# Altium schematic sheet 3Wheel_MotorDrivers_Encoders.SchDoc: Motor Controller
size A4; Organization: University of Guelph; Address1: 50 Stone Rd. E.; Address2: Guelph, Ontario; Address3: N1G 2M7; DocumentNumber: 1; Revision: 0.2; SheetNumber: 1; SheetTotal: 1
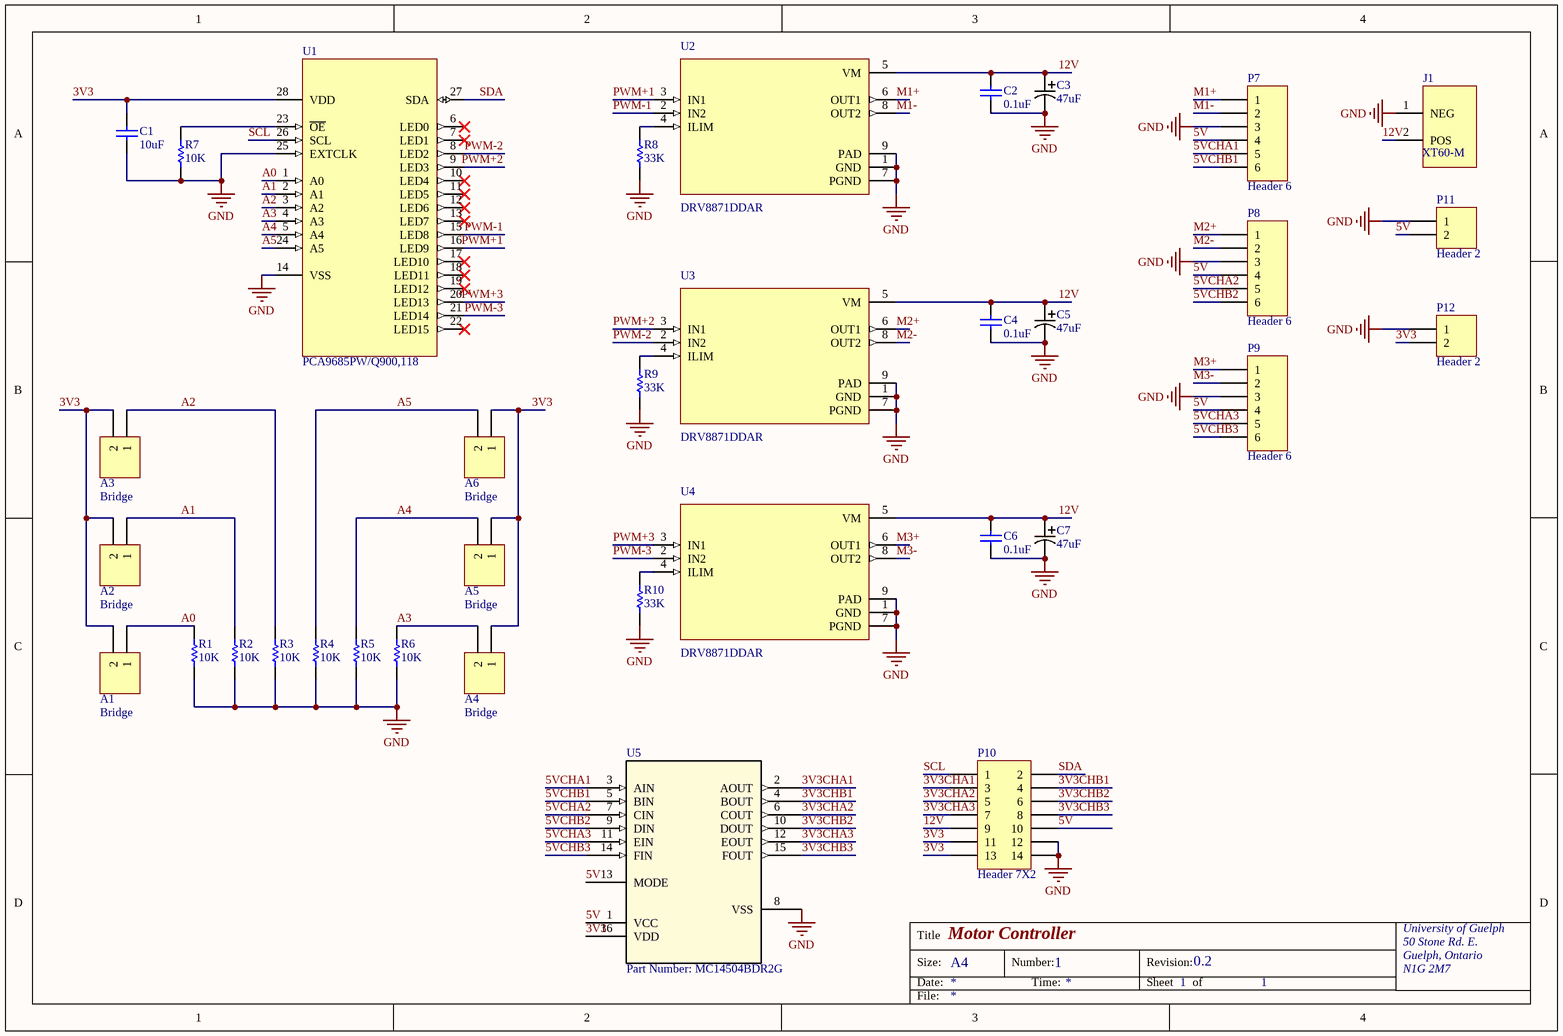
[diagram p0: 3Wheel_MotorDrivers_Encoders.SchDoc]

## Parts
A1  Bridge  [0603]
A2  Bridge  [0603]
A3  Bridge  [0603]
A4  Bridge  [0603]
A5  Bridge  [0603]
A6  Bridge  [0603]
C1  value 10uF  [6-0805_N]  (hidden comment: Cap)
C2  0.1uF  [6-0805_N]
C3  47uF  [PCAP_6.3x7.7-ELE]
C4  0.1uF  [6-0805_N]
C5  47uF  [PCAP_6.3x7.7-ELE]
C6  0.1uF  [6-0805_N]
C7  47uF  [PCAP_6.3x7.7-ELE]
J1  XT60-M  [*AMASS_XT60-M]
P7  Header 6  [HDR1X6]
P8  Header 6  [HDR1X6]
P9  Header 6  [HDR1X6]
P10  Header 7X2  [HDR2X7]
P11  Header 2  [HDR1X2]
P12  Header 2  [HDR1X2]
R1  10K  [6-0805_N]
R2  10K  [6-0805_N]
R3  10K  [6-0805_N]
R4  10K  [6-0805_N]
R5  10K  [6-0805_N]
R6  10K  [6-0805_N]
R7  value 10K  [6-0805_N]  (hidden comment: Res1)
R8  value 33K  [6-0805_N]  (hidden comment: Res1)
R9  value 33K  [6-0805_N]  (hidden comment: Res1)
R10  value 33K  [6-0805_N]  (hidden comment: Res1)
U1  PCA9685PW/Q900,118  [*SOP65P640X110-28N]
U2  DRV8871DDAR  [*SOIC127P600X170-8N]
U3  DRV8871DDAR  [*SOIC127P600X170-8N]
U4  DRV8871DDAR  [*SOIC127P600X170-8N]
U5  Part Number: MC14504BDR2G  [SOIC-16]

## Nets
GND: C1.1 C2.1 C3.2 C4.1 C5.2 C6.1 C7.2 J1.1(NEG) P7.3 P8.3 P9.3 P10.12 P10.14 P11.1 P12.1 R1.1 R2.1 R3.1 R4.1 R5.1 R6.1 R7.1 R8.1 R9.1 R10.1 U1.14(VSS) U1.25(EXTCLK) U2.1(GND) U2.7(PGND) U2.9(PAD) U3.1(GND) U3.7(PGND) U3.9(PAD) U4.1(GND) U4.7(PGND) U4.9(PAD) U5.8(VSS)
3V3: A1.2 A2.2 A3.2 A4.1 A5.1 A6.1 C1.2 P10.11 P10.13 P12.2 U1.28(VDD) U5.16(VDD)
3V3CHA1: P10.3 U5.2(AOUT)
3V3CHA2: P10.5 U5.6(COUT)
3V3CHA3: P10.7 U5.12(EOUT)
3V3CHB1: P10.4 U5.4(BOUT)
3V3CHB2: P10.6 U5.10(DOUT)
3V3CHB3: P10.8 U5.15(FOUT)
5V: P7.4 P8.4 P9.4 P10.10 P11.2 U5.1(VCC) U5.13(MODE)
5VCHA1: P7.5 U5.3(AIN)
5VCHA2: P8.5 U5.7(CIN)
5VCHA3: P9.5 U5.11(EIN)
5VCHB1: P7.6 U5.5(BIN)
5VCHB2: P8.6 U5.9(DIN)
5VCHB3: P9.6 U5.14(FIN)
12V: C2.2 C3.1 C4.2 C5.1 C6.2 C7.1 J1.2(POS) P10.9 U2.5(VM) U3.5(VM) U4.5(VM)
A0: A1.1 R1.2 U1.1(A0)
A1: A2.1 R2.2 U1.2(A1)
A2: A3.1 R3.2 U1.3(A2)
A3: A4.2 R6.2 U1.4(A3)
A4: A5.2 R5.2 U1.5(A4)
A5: A6.2 R4.2 U1.24(A5)
M1+: P7.1 U2.6(OUT1)
M1-: P7.2 U2.8(OUT2)
M2+: P8.1 U3.6(OUT1)
M2-: P8.2 U3.8(OUT2)
M3+: P9.1 U4.6(OUT1)
M3-: P9.2 U4.8(OUT2)
PWM+1: U1.16(LED9) U2.3(IN1)
PWM+2: U1.9(LED3) U3.3(IN1)
PWM+3: U1.20(LED13) U4.3(IN1)
PWM-1: U1.15(LED8) U2.2(IN2)
PWM-2: U1.8(LED2) U3.2(IN2)
PWM-3: U1.21(LED14) U4.2(IN2)
SCL: P10.1 U1.26(SCL)
SDA: P10.2 U1.27(SDA)
NetR7_2: R7.2 U1.23(~{OE})
NetR8_2: R8.2 U2.4(ILIM)
NetR9_2: R9.2 U3.4(ILIM)
NetR10_2: R10.2 U4.4(ILIM)

Not connected (* = marked no-connect by the designer): U1 6(LED0)* 7(LED1)* 10(LED4)* 11(LED5)* 12(LED6)* 13(LED7)* 17(LED10)* 18(LED11)* 19(LED12)* 22(LED15)*

## Notes on the sheet
- Title
- Size:
- Date:
- A4
- Number:
- Time:
- Revision:
- Sheet
- of
- File:

## Library data of the parts
A1-A6 P11 P12 = Header 2: Header, 2-Pin; LatestRevisionDate: 17-Jul-2002; LatestRevisionNote: Re-released for DXP Platform.; Publisher: Altium Limited
C1 C2 C4 C6 = Cap: Capacitor; Published: 8-Jun-2000; LatestRevisionDate: 17-Jul-2002; LatestRevisionNote: Re-released for DXP Platform.; PackageReference: RAD-0.3; Publisher: Altium Limited; PackageDescription: Radial Cap, Thru-Hole; 2 Leads; 0.3 in Pin Spacing
C3 C5 C7 = UWT1H470MCL1GS: No Description Available; Vendor: Nichicon; Built_By: EMA_UL_Team; Type: DEV; Manufacturer_Part_Number: UWT1H470MCL1GS; Copyright: Copyright (C) 2018 Accelerated Designs. All rights reserved; RefDes: RefDes; Value: Value
J1 = XT60-M: Plug; DC supply; XT60; male; PIN: 2; for cable; soldered; 30A; 500V; MF: AMASS; Availability: Unavailable; Package: Package Analog Devices; MP: XT60-M; Price: None; SnapEDA_Link: https://www.snapeda.com/parts/XT60-M/AMASS/view-part/2883912/?ref=snap; Value: *
P7-P9 = Header 6: Header, 6-Pin; LatestRevisionDate: 17-Jul-2002; LatestRevisionNote: Re-released for DXP Platform.; Publisher: Altium Limited
P10 = Header 7X2: Header, 7-Pin, Dual row; LatestRevisionDate: 17-Jul-2002; LatestRevisionNote: Re-released for DXP Platform.; Publisher: Altium Limited
R1-R10 = Res1: Resistor; Published: 8-Jun-2000; LatestRevisionDate: 17-Jul-2002; LatestRevisionNote: Re-released for DXP Platform.; PackageReference: AXIAL-0.3; Publisher: Altium Limited; PackageDescription: Axial Device, Thru-Hole; 2 Leads; 0.3 in Pin Spacing
U1 = PCA9685PW/Q900,118: LED Driver IC 16 Output Linear PWM Dimming 25mA 28-TSSOP; MF: NXP USA; SnapEDA_Link: https://www.snapeda.com/parts/PCA9685PW/Q900%2C118/NXP%20USA%20Inc./view-part/380795/?ref=snap; MP: PCA9685PW/Q900,118; Package: TSSOP-28 NXP Semiconductors; Digi-Key_Part_Number: 568-5931-1-ND; Digi-Key_Purchase_URL: https://www.digikey.com/product-detail/en/nxp-usa-inc/PCA9685PW-Q900,118/568-5931-1-ND/2531218?utm_source=snapeda&utm_medium=aggregator&utm_campaign=symbol; Value: *
U2-U4 = DRV8871DDAR: Unipolar Motor Driver NMOS PWM 8-SO PowerPad; MF: Texas Instruments; Digi-Key_Part_Number: 296-43024-1-ND; Digi-Key_Purchase_URL: https://www.digikey.com/product-detail/en/texas-instruments/DRV8871DDAR/296-43024-1-ND/5722182?utm_source=snapeda&utm_medium=aggregator&utm_campaign=symbol; MP: DRV8871DDAR; Package: SO-8 Texas Instruments; SnapEDA_Link: https://www.snapeda.com/parts/DRV8871DDAR/Texas%20Instruments/view-part/492651/?ref=snap; Value: *
U5 = MC14504BDR2G: No Description Available; Vendor: ON Semiconductor; Copyright: Copyright (C) 2016 Accelerated Designs. All rights reserved; Manufacturer_Part_Number: MC14504BDR2G; RefDes: RefDes; Type: DEV; Value: Value